# Altium schematic sheet Э3-8.SchDoc
size 594 x 420 mm; Address1: Address1; Address2: Address2; Address3: Address3; Address4: Address4; SheetNumber: 8; SheetTotal: 12; DocumentType: Схема электрическая принципиальная
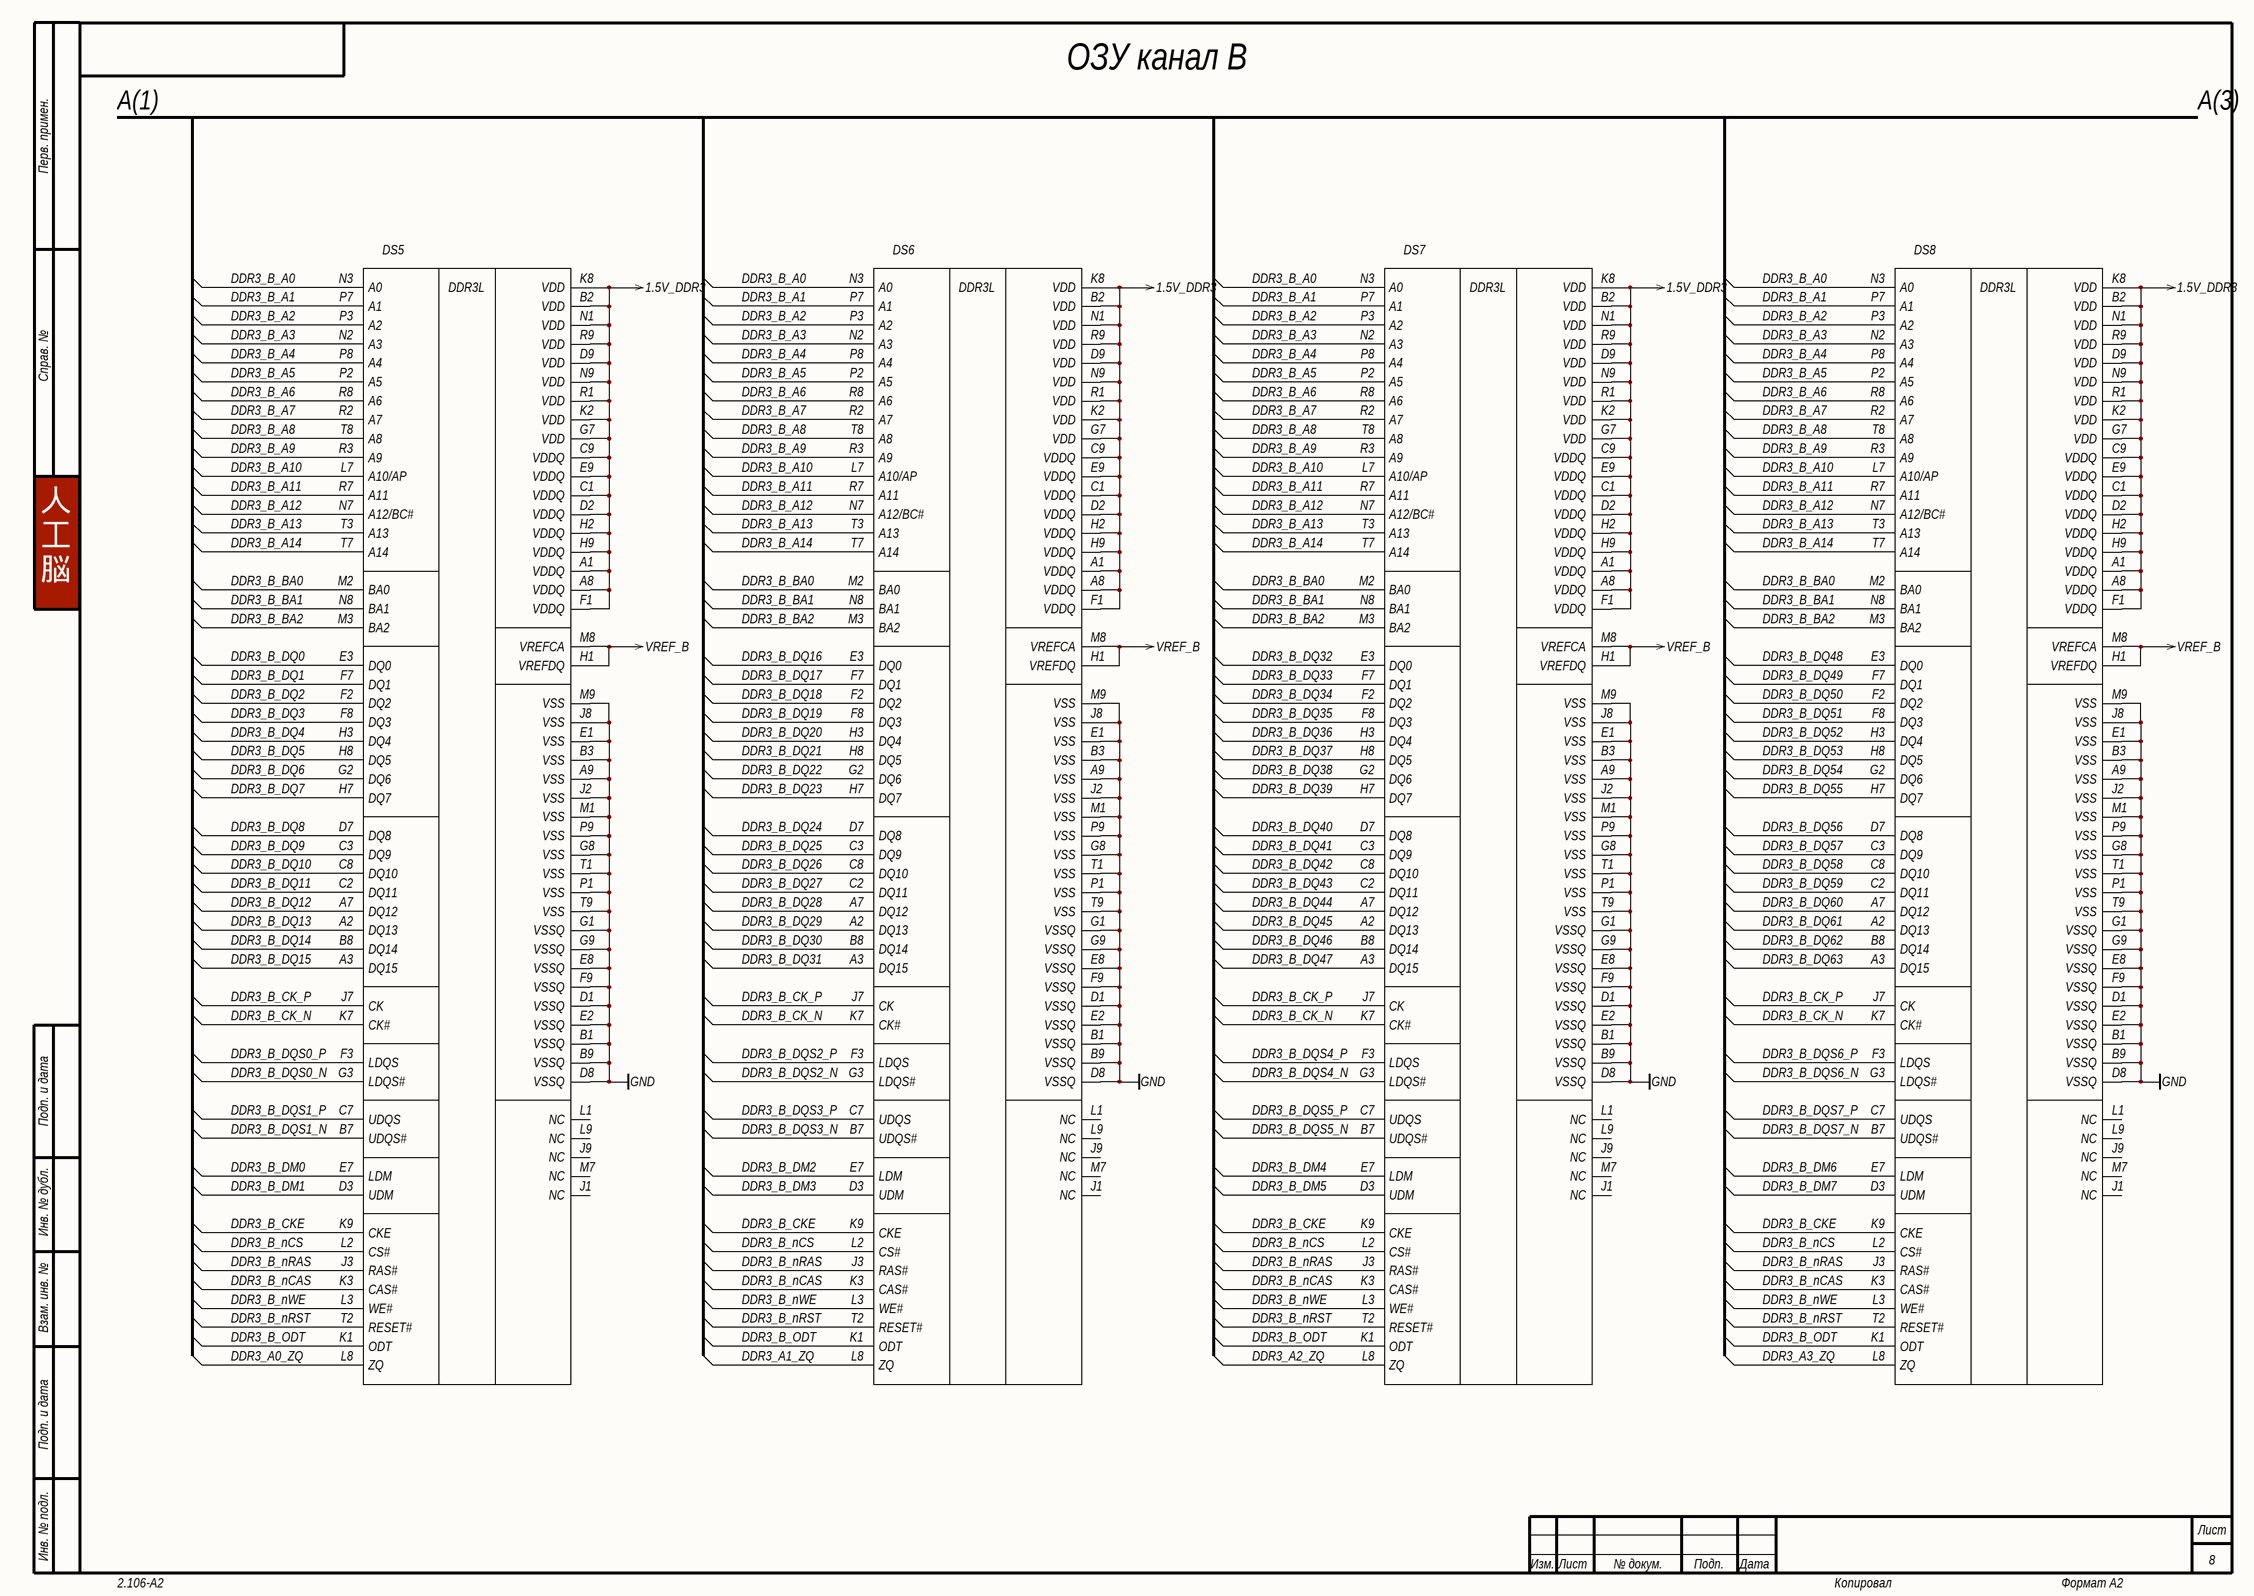
[diagram p0: Э3-8.SchDoc]

## Parts
DS5  1  [96-FBGA]  (value not drawn)
DS6  1  [96-FBGA]  (value not drawn)
DS7  1  [96-FBGA]  (value not drawn)
DS8  1  [96-FBGA]  (value not drawn)

## Nets
1.5V_DDR3: DS5.A1(VDDQ) DS5.A8(VDDQ) DS5.B2(VDD) DS5.C1(VDDQ) DS5.C9(VDDQ) DS5.D2(VDDQ) DS5.D9(VDD) DS5.E9(VDDQ) DS5.F1(VDDQ) DS5.G7(VDD) DS5.H2(VDDQ) DS5.H9(VDDQ) DS5.K2(VDD) DS5.K8(VDD) DS5.N1(VDD) DS5.N9(VDD) DS5.R1(VDD) DS5.R9(VDD) DS6.A1(VDDQ) DS6.A8(VDDQ) DS6.B2(VDD) DS6.C1(VDDQ) DS6.C9(VDDQ) DS6.D2(VDDQ) DS6.D9(VDD) DS6.E9(VDDQ) DS6.F1(VDDQ) DS6.G7(VDD) DS6.H2(VDDQ) DS6.H9(VDDQ) DS6.K2(VDD) DS6.K8(VDD) DS6.N1(VDD) DS6.N9(VDD) DS6.R1(VDD) DS6.R9(VDD) DS7.A1(VDDQ) DS7.A8(VDDQ) DS7.B2(VDD) DS7.C1(VDDQ) DS7.C9(VDDQ) DS7.D2(VDDQ) DS7.D9(VDD) DS7.E9(VDDQ) DS7.F1(VDDQ) DS7.G7(VDD) DS7.H2(VDDQ) DS7.H9(VDDQ) DS7.K2(VDD) DS7.K8(VDD) DS7.N1(VDD) DS7.N9(VDD) DS7.R1(VDD) DS7.R9(VDD) DS8.A1(VDDQ) DS8.A8(VDDQ) DS8.B2(VDD) DS8.C1(VDDQ) DS8.C9(VDDQ) DS8.D2(VDDQ) DS8.D9(VDD) DS8.E9(VDDQ) DS8.F1(VDDQ) DS8.G7(VDD) DS8.H2(VDDQ) DS8.H9(VDDQ) DS8.K2(VDD) DS8.K8(VDD) DS8.N1(VDD) DS8.N9(VDD) DS8.R1(VDD) DS8.R9(VDD)
GND: DS5.A9(VSS) DS5.B1(VSSQ) DS5.B3(VSS) DS5.B9(VSSQ) DS5.D1(VSSQ) DS5.D8(VSSQ) DS5.E1(VSS) DS5.E2(VSSQ) DS5.E8(VSSQ) DS5.F9(VSSQ) DS5.G1(VSSQ) DS5.G8(VSS) DS5.G9(VSSQ) DS5.J2(VSS) DS5.J8(VSS) DS5.M1(VSS) DS5.M9(VSS) DS5.P1(VSS) DS5.P9(VSS) DS5.T1(VSS) DS5.T9(VSS) DS6.A9(VSS) DS6.B1(VSSQ) DS6.B3(VSS) DS6.B9(VSSQ) DS6.D1(VSSQ) DS6.D8(VSSQ) DS6.E1(VSS) DS6.E2(VSSQ) DS6.E8(VSSQ) DS6.F9(VSSQ) DS6.G1(VSSQ) DS6.G8(VSS) DS6.G9(VSSQ) DS6.J2(VSS) DS6.J8(VSS) DS6.M1(VSS) DS6.M9(VSS) DS6.P1(VSS) DS6.P9(VSS) DS6.T1(VSS) DS6.T9(VSS) DS7.A9(VSS) DS7.B1(VSSQ) DS7.B3(VSS) DS7.B9(VSSQ) DS7.D1(VSSQ) DS7.D8(VSSQ) DS7.E1(VSS) DS7.E2(VSSQ) DS7.E8(VSSQ) DS7.F9(VSSQ) DS7.G1(VSSQ) DS7.G8(VSS) DS7.G9(VSSQ) DS7.J2(VSS) DS7.J8(VSS) DS7.M1(VSS) DS7.M9(VSS) DS7.P1(VSS) DS7.P9(VSS) DS7.T1(VSS) DS7.T9(VSS) DS8.A9(VSS) DS8.B1(VSSQ) DS8.B3(VSS) DS8.B9(VSSQ) DS8.D1(VSSQ) DS8.D8(VSSQ) DS8.E1(VSS) DS8.E2(VSSQ) DS8.E8(VSSQ) DS8.F9(VSSQ) DS8.G1(VSSQ) DS8.G8(VSS) DS8.G9(VSSQ) DS8.J2(VSS) DS8.J8(VSS) DS8.M1(VSS) DS8.M9(VSS) DS8.P1(VSS) DS8.P9(VSS) DS8.T1(VSS) DS8.T9(VSS)
VREF_B: DS5.H1(VREFDQ) DS5.M8(VREFCA) DS6.H1(VREFDQ) DS6.M8(VREFCA) DS7.H1(VREFDQ) DS7.M8(VREFCA) DS8.H1(VREFDQ) DS8.M8(VREFCA)
DDR3_A0_ZQ: DS5.L8(ZQ)
DDR3_A1_ZQ: DS6.L8(ZQ)
DDR3_A2_ZQ: DS7.L8(ZQ)
DDR3_A3_ZQ: DS8.L8(ZQ)
DDR3_B_A0: DS5.N3(A0) DS6.N3(A0) DS7.N3(A0) DS8.N3(A0)
DDR3_B_A1: DS5.P7(A1) DS6.P7(A1) DS7.P7(A1) DS8.P7(A1)
DDR3_B_A2: DS5.P3(A2) DS6.P3(A2) DS7.P3(A2) DS8.P3(A2)
DDR3_B_A3: DS5.N2(A3) DS6.N2(A3) DS7.N2(A3) DS8.N2(A3)
DDR3_B_A4: DS5.P8(A4) DS6.P8(A4) DS7.P8(A4) DS8.P8(A4)
DDR3_B_A5: DS5.P2(A5) DS6.P2(A5) DS7.P2(A5) DS8.P2(A5)
DDR3_B_A6: DS5.R8(A6) DS6.R8(A6) DS7.R8(A6) DS8.R8(A6)
DDR3_B_A7: DS5.R2(A7) DS6.R2(A7) DS7.R2(A7) DS8.R2(A7)
DDR3_B_A8: DS5.T8(A8) DS6.T8(A8) DS7.T8(A8) DS8.T8(A8)
DDR3_B_A9: DS5.R3(A9) DS6.R3(A9) DS7.R3(A9) DS8.R3(A9)
DDR3_B_A10: DS5.L7(A10/AP) DS6.L7(A10/AP) DS7.L7(A10/AP) DS8.L7(A10/AP)
DDR3_B_A11: DS5.R7(A11) DS6.R7(A11) DS7.R7(A11) DS8.R7(A11)
DDR3_B_A12: DS5.N7(A12/BC#) DS6.N7(A12/BC#) DS7.N7(A12/BC#) DS8.N7(A12/BC#)
DDR3_B_A13: DS5.T3(A13) DS6.T3(A13) DS7.T3(A13) DS8.T3(A13)
DDR3_B_A14: DS5.T7(A14) DS6.T7(A14) DS7.T7(A14) DS8.T7(A14)
DDR3_B_BA0: DS5.M2(BA0) DS6.M2(BA0) DS7.M2(BA0) DS8.M2(BA0)
DDR3_B_BA1: DS5.N8(BA1) DS6.N8(BA1) DS7.N8(BA1) DS8.N8(BA1)
DDR3_B_BA2: DS5.M3(BA2) DS6.M3(BA2) DS7.M3(BA2) DS8.M3(BA2)
DDR3_B_CK_N: DS5.K7(CK#) DS6.K7(CK#) DS7.K7(CK#) DS8.K7(CK#)
DDR3_B_CK_P: DS5.J7(CK) DS6.J7(CK) DS7.J7(CK) DS8.J7(CK)
DDR3_B_CKE: DS5.K9(CKE) DS6.K9(CKE) DS7.K9(CKE) DS8.K9(CKE)
DDR3_B_DM0: DS5.E7(LDM)
DDR3_B_DM1: DS5.D3(UDM)
DDR3_B_DM2: DS6.E7(LDM)
DDR3_B_DM3: DS6.D3(UDM)
DDR3_B_DM4: DS7.E7(LDM)
DDR3_B_DM5: DS7.D3(UDM)
DDR3_B_DM6: DS8.E7(LDM)
DDR3_B_DM7: DS8.D3(UDM)
DDR3_B_DQ0: DS5.E3(DQ0)
DDR3_B_DQ1: DS5.F7(DQ1)
DDR3_B_DQ2: DS5.F2(DQ2)
DDR3_B_DQ3: DS5.F8(DQ3)
DDR3_B_DQ4: DS5.H3(DQ4)
DDR3_B_DQ5: DS5.H8(DQ5)
DDR3_B_DQ6: DS5.G2(DQ6)
DDR3_B_DQ7: DS5.H7(DQ7)
DDR3_B_DQ8: DS5.D7(DQ8)
DDR3_B_DQ9: DS5.C3(DQ9)
DDR3_B_DQ10: DS5.C8(DQ10)
DDR3_B_DQ11: DS5.C2(DQ11)
DDR3_B_DQ12: DS5.A7(DQ12)
DDR3_B_DQ13: DS5.A2(DQ13)
DDR3_B_DQ14: DS5.B8(DQ14)
DDR3_B_DQ15: DS5.A3(DQ15)
DDR3_B_DQ16: DS6.E3(DQ0)
DDR3_B_DQ17: DS6.F7(DQ1)
DDR3_B_DQ18: DS6.F2(DQ2)
DDR3_B_DQ19: DS6.F8(DQ3)
DDR3_B_DQ20: DS6.H3(DQ4)
DDR3_B_DQ21: DS6.H8(DQ5)
DDR3_B_DQ22: DS6.G2(DQ6)
DDR3_B_DQ23: DS6.H7(DQ7)
DDR3_B_DQ24: DS6.D7(DQ8)
DDR3_B_DQ25: DS6.C3(DQ9)
DDR3_B_DQ26: DS6.C8(DQ10)
DDR3_B_DQ27: DS6.C2(DQ11)
DDR3_B_DQ28: DS6.A7(DQ12)
DDR3_B_DQ29: DS6.A2(DQ13)
DDR3_B_DQ30: DS6.B8(DQ14)
DDR3_B_DQ31: DS6.A3(DQ15)
DDR3_B_DQ32: DS7.E3(DQ0)
DDR3_B_DQ33: DS7.F7(DQ1)
DDR3_B_DQ34: DS7.F2(DQ2)
DDR3_B_DQ35: DS7.F8(DQ3)
DDR3_B_DQ36: DS7.H3(DQ4)
DDR3_B_DQ37: DS7.H8(DQ5)
DDR3_B_DQ38: DS7.G2(DQ6)
DDR3_B_DQ39: DS7.H7(DQ7)
DDR3_B_DQ40: DS7.D7(DQ8)
DDR3_B_DQ41: DS7.C3(DQ9)
DDR3_B_DQ42: DS7.C8(DQ10)
DDR3_B_DQ43: DS7.C2(DQ11)
DDR3_B_DQ44: DS7.A7(DQ12)
DDR3_B_DQ45: DS7.A2(DQ13)
DDR3_B_DQ46: DS7.B8(DQ14)
DDR3_B_DQ47: DS7.A3(DQ15)
DDR3_B_DQ48: DS8.E3(DQ0)
DDR3_B_DQ49: DS8.F7(DQ1)
DDR3_B_DQ50: DS8.F2(DQ2)
DDR3_B_DQ51: DS8.F8(DQ3)
DDR3_B_DQ52: DS8.H3(DQ4)
DDR3_B_DQ53: DS8.H8(DQ5)
DDR3_B_DQ54: DS8.G2(DQ6)
DDR3_B_DQ55: DS8.H7(DQ7)
DDR3_B_DQ56: DS8.D7(DQ8)
DDR3_B_DQ57: DS8.C3(DQ9)
DDR3_B_DQ58: DS8.C8(DQ10)
DDR3_B_DQ59: DS8.C2(DQ11)
DDR3_B_DQ60: DS8.A7(DQ12)
DDR3_B_DQ61: DS8.A2(DQ13)
DDR3_B_DQ62: DS8.B8(DQ14)
DDR3_B_DQ63: DS8.A3(DQ15)
DDR3_B_DQS0_N: DS5.G3(LDQS#)
DDR3_B_DQS0_P: DS5.F3(LDQS)
DDR3_B_DQS1_N: DS5.B7(UDQS#)
DDR3_B_DQS1_P: DS5.C7(UDQS)
DDR3_B_DQS2_N: DS6.G3(LDQS#)
DDR3_B_DQS2_P: DS6.F3(LDQS)
DDR3_B_DQS3_N: DS6.B7(UDQS#)
DDR3_B_DQS3_P: DS6.C7(UDQS)
DDR3_B_DQS4_N: DS7.G3(LDQS#)
DDR3_B_DQS4_P: DS7.F3(LDQS)
DDR3_B_DQS5_N: DS7.B7(UDQS#)
DDR3_B_DQS5_P: DS7.C7(UDQS)
DDR3_B_DQS6_N: DS8.G3(LDQS#)
DDR3_B_DQS6_P: DS8.F3(LDQS)
DDR3_B_DQS7_N: DS8.B7(UDQS#)
DDR3_B_DQS7_P: DS8.C7(UDQS)
DDR3_B_nCAS: DS5.K3(CAS#) DS6.K3(CAS#) DS7.K3(CAS#) DS8.K3(CAS#)
DDR3_B_nCS: DS5.L2(CS#) DS6.L2(CS#) DS7.L2(CS#) DS8.L2(CS#)
DDR3_B_nRAS: DS5.J3(RAS#) DS6.J3(RAS#) DS7.J3(RAS#) DS8.J3(RAS#)
DDR3_B_nRST: DS5.T2(RESET#) DS6.T2(RESET#) DS7.T2(RESET#) DS8.T2(RESET#)
DDR3_B_nWE: DS5.L3(WE#) DS6.L3(WE#) DS7.L3(WE#) DS8.L3(WE#)
DDR3_B_ODT: DS5.K1(ODT) DS6.K1(ODT) DS7.K1(ODT) DS8.K1(ODT)

Not connected (* = marked no-connect by the designer): DS5 J1(NC) J9(NC) L1(NC) L9(NC) M7(NC); DS6 J1(NC) J9(NC) L1(NC) L9(NC) M7(NC); DS7 J1(NC) J9(NC) L1(NC) L9(NC) M7(NC); DS8 J1(NC) J9(NC) L1(NC) L9(NC) M7(NC)

## Notes on the sheet
- A(1)
- ОЗУ канал B
- A(3)
- 人
  工
  脳
- Перв. примен.
- Справ. №
- Подп. и дата
- Инв. № дубл.
- Взам. инв. №
- Инв. № подл.
- Изм.
- Лист
- № докум.
- Подп.
- Дата
- 2.106-A2
- Копировал
- Формат А2
- (in symbol MT41K256M16TW-107IT:P) DDR3L

## Library data of the parts
DS5-DS8 = MT41K256M16TW-107IT:P: 32 Megx16x8 banks DDR3L SDRAM; Manufacturer: Micron Technology, Inc.; TemperatureRange: -...+°C; ComponentType: Микросхема; Install: 1